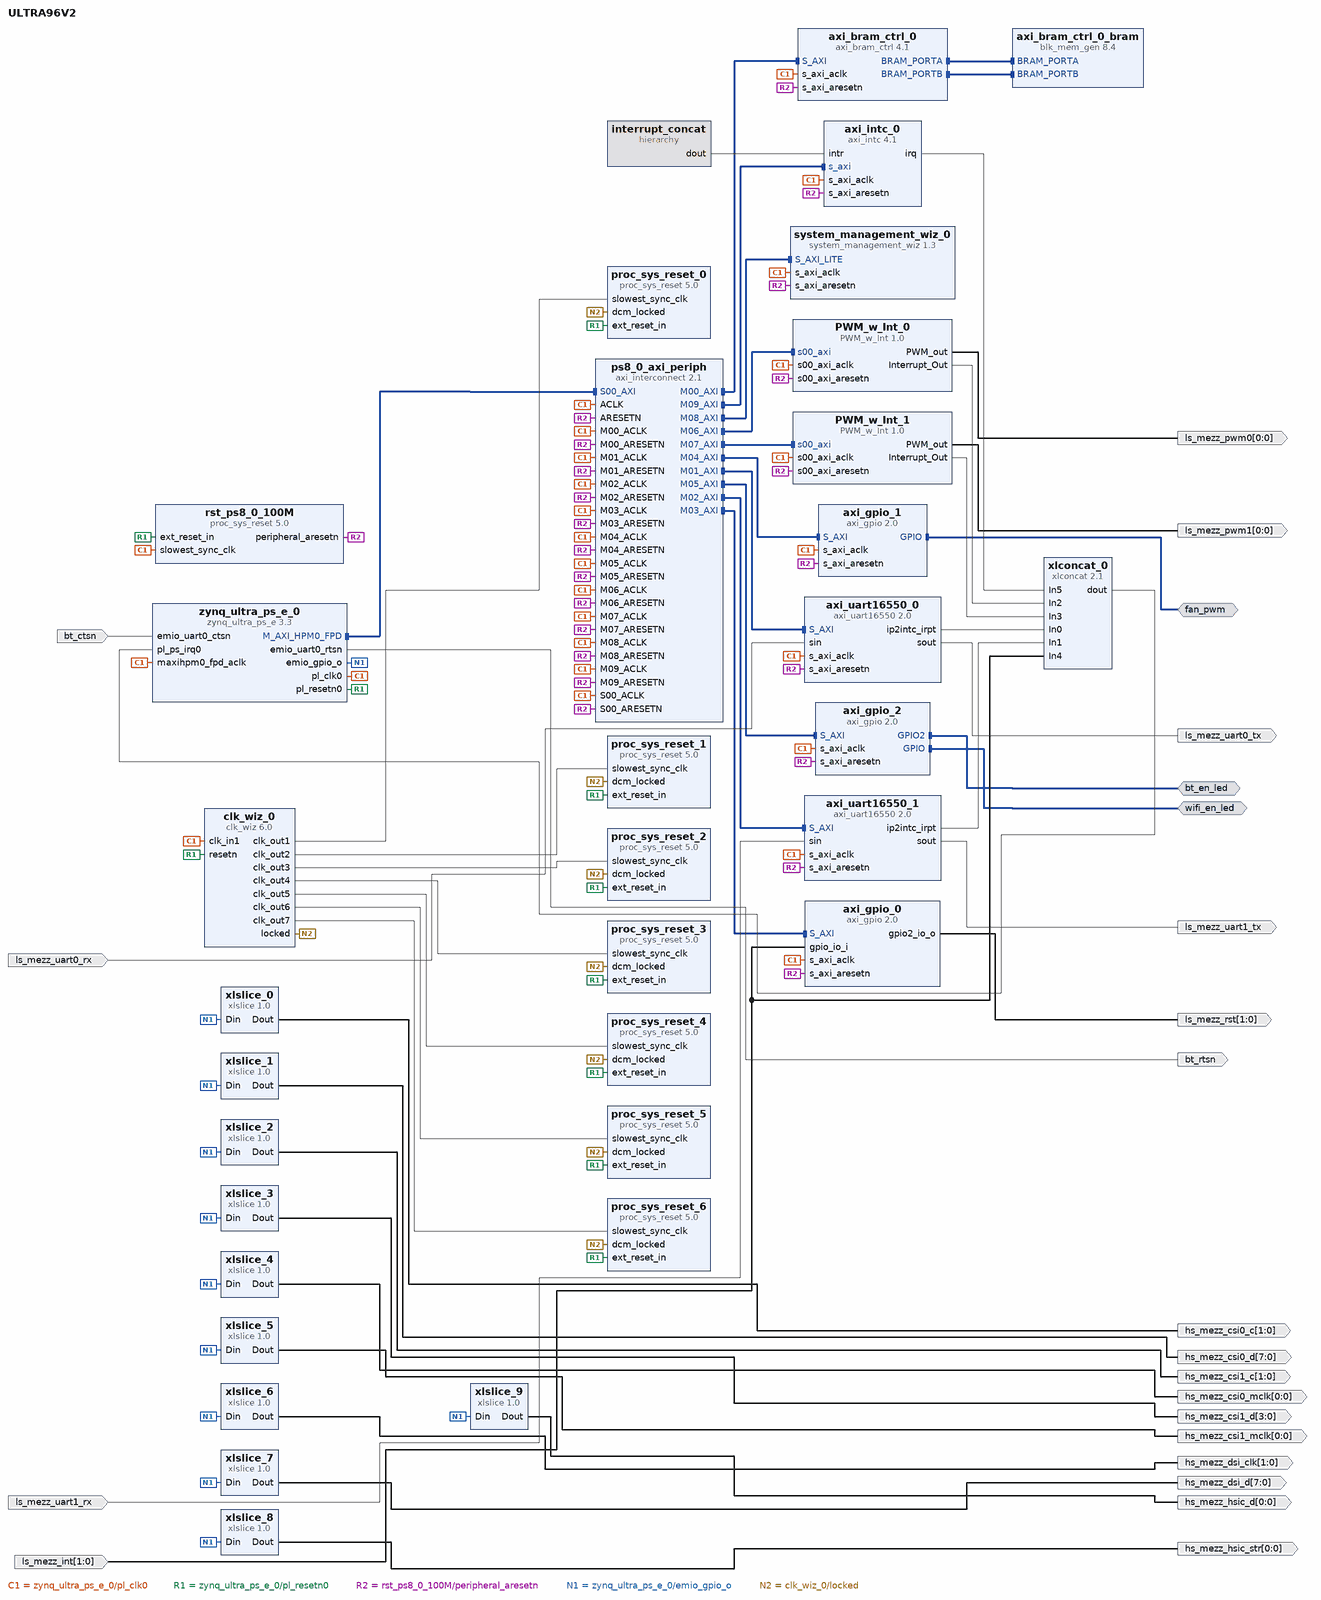
[diagram p0: block diagram of the top level]
# Vivado block design ULTRA96V2, xczu3eg-sbva484-1-e, Vivado 2019.2
create_bd_design ULTRA96V2

create_bd_intf_port -mode Master -vlnv xilinx.com:interface:gpio_rtl:1.0 fan_pwm
create_bd_intf_port -mode Master -vlnv xilinx.com:interface:gpio_rtl:1.0 wifi_en_led
create_bd_intf_port -mode Master -vlnv xilinx.com:interface:gpio_rtl:1.0 bt_en_led
create_bd_port -dir I ls_mezz_uart0_rx
create_bd_port -dir O ls_mezz_uart0_tx
create_bd_port -dir I ls_mezz_uart1_rx
create_bd_port -dir O ls_mezz_uart1_tx
create_bd_port -dir I -from 1 -to 0 ls_mezz_int
create_bd_port -dir O -from 1 -to 0 ls_mezz_rst
create_bd_port -dir O -from 0 -to 0 ls_mezz_pwm0
create_bd_port -dir O -from 0 -to 0 ls_mezz_pwm1
create_bd_port -dir I bt_ctsn
create_bd_port -dir O bt_rtsn
create_bd_port -dir O -from 1 -to 0 hs_mezz_csi0_c
create_bd_port -dir O -from 7 -to 0 hs_mezz_csi0_d
create_bd_port -dir O -from 1 -to 0 hs_mezz_csi1_c
create_bd_port -dir O -from 3 -to 0 hs_mezz_csi1_d
create_bd_port -dir O -from 0 -to 0 hs_mezz_csi0_mclk
create_bd_port -dir O -from 0 -to 0 hs_mezz_csi1_mclk
create_bd_port -dir O -from 1 -to 0 hs_mezz_dsi_clk
create_bd_port -dir O -from 7 -to 0 hs_mezz_dsi_d
create_bd_port -dir O -from 0 -to 0 hs_mezz_hsic_str
create_bd_port -dir O -from 0 -to 0 hs_mezz_hsic_d

create_bd_cell -type ip -vlnv xilinx.com:ip:zynq_ultra_ps_e:3.3 zynq_ultra_ps_e_0
set_property -dict [list \
  CONFIG.PSU_BANK_0_IO_STANDARD LVCMOS18 \
  CONFIG.PSU_BANK_1_IO_STANDARD LVCMOS18 \
  CONFIG.PSU_BANK_2_IO_STANDARD LVCMOS18 \
  CONFIG.PSU_BANK_3_IO_STANDARD LVCMOS18 \
  CONFIG.PSU_USB3__DUAL_CLOCK_ENABLE 1 \
  CONFIG.PSU__CAN1__PERIPHERAL__ENABLE 0 \
  CONFIG.PSU__CRF_APB__ACPU_CTRL__SRCSEL APLL \
  CONFIG.PSU__CRF_APB__APLL_CTRL__SRCSEL PSS_REF_CLK \
  CONFIG.PSU__CRF_APB__DBG_FPD_CTRL__SRCSEL IOPLL \
  CONFIG.PSU__CRF_APB__DBG_TRACE_CTRL__SRCSEL IOPLL \
  CONFIG.PSU__CRF_APB__DBG_TSTMP_CTRL__SRCSEL IOPLL \
  CONFIG.PSU__CRF_APB__DDR_CTRL__FREQMHZ 533 \
  CONFIG.PSU__CRF_APB__DDR_CTRL__SRCSEL DPLL \
  CONFIG.PSU__CRF_APB__DPDMA_REF_CTRL__SRCSEL APLL \
  CONFIG.PSU__CRF_APB__DPLL_CTRL__SRCSEL PSS_REF_CLK \
  CONFIG.PSU__CRF_APB__DP_AUDIO_REF_CTRL__SRCSEL RPLL \
  CONFIG.PSU__CRF_APB__DP_STC_REF_CTRL__SRCSEL RPLL \
  CONFIG.PSU__CRF_APB__DP_VIDEO_REF_CTRL__SRCSEL VPLL \
  CONFIG.PSU__CRF_APB__GDMA_REF_CTRL__SRCSEL APLL \
  CONFIG.PSU__CRF_APB__GPU_REF_CTRL__SRCSEL IOPLL \
  CONFIG.PSU__CRF_APB__TOPSW_LSBUS_CTRL__SRCSEL IOPLL \
  CONFIG.PSU__CRF_APB__TOPSW_MAIN_CTRL__SRCSEL DPLL \
  CONFIG.PSU__CRF_APB__VPLL_CTRL__SRCSEL PSS_REF_CLK \
  CONFIG.PSU__CRF_APB__VPLL_FRAC_CFG__ENABLED 1 \
  CONFIG.PSU__CRL_APB__ADMA_REF_CTRL__SRCSEL IOPLL \
  CONFIG.PSU__CRL_APB__CAN1_REF_CTRL__SRCSEL IOPLL \
  CONFIG.PSU__CRL_APB__CPU_R5_CTRL__SRCSEL IOPLL \
  CONFIG.PSU__CRL_APB__CSU_PLL_CTRL__FREQMHZ 400 \
  CONFIG.PSU__CRL_APB__CSU_PLL_CTRL__SRCSEL IOPLL \
  CONFIG.PSU__CRL_APB__DBG_LPD_CTRL__SRCSEL IOPLL \
  CONFIG.PSU__CRL_APB__GEM3_REF_CTRL__SRCSEL IOPLL \
  CONFIG.PSU__CRL_APB__I2C0_REF_CTRL__SRCSEL IOPLL \
  CONFIG.PSU__CRL_APB__I2C1_REF_CTRL__SRCSEL IOPLL \
  CONFIG.PSU__CRL_APB__IOPLL_CTRL__DIV2 0 \
  CONFIG.PSU__CRL_APB__IOPLL_CTRL__SRCSEL PSS_REF_CLK \
  CONFIG.PSU__CRL_APB__IOU_SWITCH_CTRL__SRCSEL IOPLL \
  CONFIG.PSU__CRL_APB__LPD_LSBUS_CTRL__SRCSEL IOPLL \
  CONFIG.PSU__CRL_APB__LPD_SWITCH_CTRL__SRCSEL IOPLL \
  CONFIG.PSU__CRL_APB__PCAP_CTRL__SRCSEL IOPLL \
  CONFIG.PSU__CRL_APB__PL0_REF_CTRL__SRCSEL IOPLL \
  CONFIG.PSU__CRL_APB__QSPI_REF_CTRL__SRCSEL IOPLL \
  CONFIG.PSU__CRL_APB__RPLL_CTRL__SRCSEL PSS_REF_CLK \
  CONFIG.PSU__CRL_APB__RPLL_FRAC_CFG__ENABLED 1 \
  CONFIG.PSU__CRL_APB__SDIO0_REF_CTRL__SRCSEL IOPLL \
  CONFIG.PSU__CRL_APB__SDIO1_REF_CTRL__SRCSEL IOPLL \
  CONFIG.PSU__CRL_APB__SPI0_REF_CTRL__SRCSEL IOPLL \
  CONFIG.PSU__CRL_APB__SPI1_REF_CTRL__SRCSEL IOPLL \
  CONFIG.PSU__CRL_APB__TIMESTAMP_REF_CTRL__SRCSEL IOPLL \
  CONFIG.PSU__CRL_APB__UART0_REF_CTRL__SRCSEL IOPLL \
  CONFIG.PSU__CRL_APB__UART1_REF_CTRL__SRCSEL IOPLL \
  CONFIG.PSU__CRL_APB__USB0_BUS_REF_CTRL__FREQMHZ 250 \
  CONFIG.PSU__CRL_APB__USB0_BUS_REF_CTRL__SRCSEL IOPLL \
  CONFIG.PSU__CRL_APB__USB3_DUAL_REF_CTRL__FREQMHZ 20 \
  CONFIG.PSU__CRL_APB__USB3_DUAL_REF_CTRL__SRCSEL IOPLL \
  CONFIG.PSU__CRL_APB__USB3__ENABLE 1 \
  CONFIG.PSU__CSUPMU__PERIPHERAL__VALID 1 \
  CONFIG.PSU__DDRC__BUS_WIDTH {32 Bit} \
  CONFIG.PSU__DDRC__DEVICE_CAPACITY {16384 MBits} \
  CONFIG.PSU__DDRC__DRAM_WIDTH {32 Bits} \
  CONFIG.PSU__DDRC__ECC Disabled \
  CONFIG.PSU__DDRC__MEMORY_TYPE {LPDDR 4} \
  CONFIG.PSU__DDRC__SPEED_BIN LPDDR4_1066 \
  CONFIG.PSU__DDR_HIGH_ADDRESS_GUI_ENABLE 0 \
  CONFIG.PSU__DDR__INTERFACE__FREQMHZ 266.500 \
  CONFIG.PSU__DISPLAYPORT__LANE0__ENABLE 1 \
  CONFIG.PSU__DISPLAYPORT__LANE0__IO {GT Lane1} \
  CONFIG.PSU__DISPLAYPORT__LANE1__ENABLE 1 \
  CONFIG.PSU__DISPLAYPORT__LANE1__IO {GT Lane0} \
  CONFIG.PSU__DISPLAYPORT__PERIPHERAL__ENABLE 1 \
  CONFIG.PSU__DLL__ISUSED 1 \
  CONFIG.PSU__DPAUX__PERIPHERAL__ENABLE 1 \
  CONFIG.PSU__DPAUX__PERIPHERAL__IO {MIO 27 .. 30} \
  CONFIG.PSU__DP__LANE_SEL {Dual Lower} \
  CONFIG.PSU__DP__REF_CLK_FREQ 27 \
  CONFIG.PSU__DP__REF_CLK_SEL {Ref Clk1} \
  CONFIG.PSU__ENET3__PERIPHERAL__ENABLE 0 \
  CONFIG.PSU__FPGA_PL0_ENABLE 1 \
  CONFIG.PSU__GPIO0_MIO__IO {MIO 0 .. 25} \
  CONFIG.PSU__GPIO0_MIO__PERIPHERAL__ENABLE 1 \
  CONFIG.PSU__GPIO1_MIO__IO {MIO 26 .. 51} \
  CONFIG.PSU__GPIO1_MIO__PERIPHERAL__ENABLE 1 \
  CONFIG.PSU__GPIO2_MIO__IO {MIO 52 .. 77} \
  CONFIG.PSU__GPIO2_MIO__PERIPHERAL__ENABLE 1 \
  CONFIG.PSU__GPIO_EMIO_WIDTH 30 \
  CONFIG.PSU__GPIO_EMIO__PERIPHERAL__ENABLE 1 \
  CONFIG.PSU__GPIO_EMIO__PERIPHERAL__IO 30 \
  CONFIG.PSU__GT__LINK_SPEED HBR \
  CONFIG.PSU__GT__PRE_EMPH_LVL_4 0 \
  CONFIG.PSU__GT__VLT_SWNG_LVL_4 0 \
  CONFIG.PSU__I2C0__PERIPHERAL__ENABLE 0 \
  CONFIG.PSU__I2C1__PERIPHERAL__ENABLE 1 \
  CONFIG.PSU__I2C1__PERIPHERAL__IO {MIO 4 .. 5} \
  CONFIG.PSU__IOU_SLCR__IOU_TTC_APB_CLK__TTC0_SEL APB \
  CONFIG.PSU__IOU_SLCR__IOU_TTC_APB_CLK__TTC1_SEL APB \
  CONFIG.PSU__IOU_SLCR__IOU_TTC_APB_CLK__TTC2_SEL APB \
  CONFIG.PSU__IOU_SLCR__IOU_TTC_APB_CLK__TTC3_SEL APB \
  CONFIG.PSU__MAXIGP0__DATA_WIDTH 128 \
  CONFIG.PSU__OVERRIDE__BASIC_CLOCK 1 \
  CONFIG.PSU__PMU_COHERENCY 0 \
  CONFIG.PSU__PMU__AIBACK__ENABLE 0 \
  CONFIG.PSU__PMU__EMIO_GPI__ENABLE 0 \
  CONFIG.PSU__PMU__EMIO_GPO__ENABLE 0 \
  CONFIG.PSU__PMU__GPI0__ENABLE 1 \
  CONFIG.PSU__PMU__GPI0__IO {MIO 26} \
  CONFIG.PSU__PMU__GPI1__ENABLE 0 \
  CONFIG.PSU__PMU__GPI2__ENABLE 0 \
  CONFIG.PSU__PMU__GPI3__ENABLE 0 \
  CONFIG.PSU__PMU__GPI4__ENABLE 0 \
  CONFIG.PSU__PMU__GPI5__ENABLE 0 \
  CONFIG.PSU__PMU__GPO0__ENABLE 1 \
  CONFIG.PSU__PMU__GPO0__IO {MIO 32} \
  CONFIG.PSU__PMU__GPO1__ENABLE 1 \
  CONFIG.PSU__PMU__GPO1__IO {MIO 33} \
  CONFIG.PSU__PMU__GPO2__ENABLE 1 \
  CONFIG.PSU__PMU__GPO2__IO {MIO 34} \
  CONFIG.PSU__PMU__GPO2__POLARITY high \
  CONFIG.PSU__PMU__GPO3__ENABLE 0 \
  CONFIG.PSU__PMU__GPO4__ENABLE 0 \
  CONFIG.PSU__PMU__GPO5__ENABLE 0 \
  CONFIG.PSU__PMU__PERIPHERAL__ENABLE 1 \
  CONFIG.PSU__PMU__PLERROR__ENABLE 0 \
  CONFIG.PSU__PRESET_APPLIED 1 \
  CONFIG.PSU__PSS_REF_CLK__FREQMHZ 33.333333 \
  CONFIG.PSU__QSPI__PERIPHERAL__ENABLE 0 \
  CONFIG.PSU__SATA__PERIPHERAL__ENABLE 0 \
  CONFIG.PSU__SD0__DATA_TRANSFER_MODE 4Bit \
  CONFIG.PSU__SD0__GRP_CD__ENABLE 1 \
  CONFIG.PSU__SD0__GRP_CD__IO {MIO 24} \
  CONFIG.PSU__SD0__PERIPHERAL__ENABLE 1 \
  CONFIG.PSU__SD0__PERIPHERAL__IO {MIO 13 .. 16 21 22} \
  CONFIG.PSU__SD0__SLOT_TYPE {SD 2.0} \
  CONFIG.PSU__SD1_COHERENCY 0 \
  CONFIG.PSU__SD1_ROUTE_THROUGH_FPD 0 \
  CONFIG.PSU__SD1__DATA_TRANSFER_MODE 4Bit \
  CONFIG.PSU__SD1__GRP_CD__ENABLE 0 \
  CONFIG.PSU__SD1__GRP_POW__ENABLE 0 \
  CONFIG.PSU__SD1__GRP_WP__ENABLE 0 \
  CONFIG.PSU__SD1__PERIPHERAL__ENABLE 1 \
  CONFIG.PSU__SD1__PERIPHERAL__IO {MIO 46 .. 51} \
  CONFIG.PSU__SD1__SLOT_TYPE {SD 2.0} \
  CONFIG.PSU__SPI0__GRP_SS0__IO {MIO 41} \
  CONFIG.PSU__SPI0__GRP_SS1__ENABLE 1 \
  CONFIG.PSU__SPI0__GRP_SS1__IO {MIO 40} \
  CONFIG.PSU__SPI0__GRP_SS2__ENABLE 1 \
  CONFIG.PSU__SPI0__GRP_SS2__IO {MIO 39} \
  CONFIG.PSU__SPI0__PERIPHERAL__ENABLE 1 \
  CONFIG.PSU__SPI0__PERIPHERAL__IO {MIO 38 .. 43} \
  CONFIG.PSU__SPI1__GRP_SS0__IO {MIO 9} \
  CONFIG.PSU__SPI1__PERIPHERAL__ENABLE 1 \
  CONFIG.PSU__SPI1__PERIPHERAL__IO {MIO 6 .. 11} \
  CONFIG.PSU__SWDT0__CLOCK__ENABLE 0 \
  CONFIG.PSU__SWDT0__PERIPHERAL__ENABLE 1 \
  CONFIG.PSU__SWDT0__RESET__ENABLE 0 \
  CONFIG.PSU__SWDT1__CLOCK__ENABLE 0 \
  CONFIG.PSU__SWDT1__PERIPHERAL__ENABLE 1 \
  CONFIG.PSU__SWDT1__RESET__ENABLE 0 \
  CONFIG.PSU__TTC0__CLOCK__ENABLE 0 \
  CONFIG.PSU__TTC0__PERIPHERAL__ENABLE 1 \
  CONFIG.PSU__TTC0__WAVEOUT__ENABLE 0 \
  CONFIG.PSU__TTC1__CLOCK__ENABLE 0 \
  CONFIG.PSU__TTC1__PERIPHERAL__ENABLE 1 \
  CONFIG.PSU__TTC1__WAVEOUT__ENABLE 0 \
  CONFIG.PSU__TTC2__CLOCK__ENABLE 0 \
  CONFIG.PSU__TTC2__PERIPHERAL__ENABLE 1 \
  CONFIG.PSU__TTC2__WAVEOUT__ENABLE 0 \
  CONFIG.PSU__TTC3__CLOCK__ENABLE 0 \
  CONFIG.PSU__TTC3__PERIPHERAL__ENABLE 1 \
  CONFIG.PSU__TTC3__WAVEOUT__ENABLE 0 \
  CONFIG.PSU__UART0__BAUD_RATE 115200 \
  CONFIG.PSU__UART0__MODEM__ENABLE 1 \
  CONFIG.PSU__UART0__PERIPHERAL__ENABLE 1 \
  CONFIG.PSU__UART0__PERIPHERAL__IO {MIO 2 .. 3} \
  CONFIG.PSU__UART1__BAUD_RATE 115200 \
  CONFIG.PSU__UART1__MODEM__ENABLE 0 \
  CONFIG.PSU__UART1__PERIPHERAL__ENABLE 1 \
  CONFIG.PSU__UART1__PERIPHERAL__IO {MIO 0 .. 1} \
  CONFIG.PSU__USB0_COHERENCY 0 \
  CONFIG.PSU__USB0__PERIPHERAL__ENABLE 1 \
  CONFIG.PSU__USB0__PERIPHERAL__IO {MIO 52 .. 63} \
  CONFIG.PSU__USB0__REF_CLK_FREQ 26 \
  CONFIG.PSU__USB0__REF_CLK_SEL {Ref Clk0} \
  CONFIG.PSU__USB1__PERIPHERAL__ENABLE 1 \
  CONFIG.PSU__USB1__PERIPHERAL__IO {MIO 64 .. 75} \
  CONFIG.PSU__USB1__REF_CLK_FREQ 26 \
  CONFIG.PSU__USB1__REF_CLK_SEL {Ref Clk0} \
  CONFIG.PSU__USB2_0__EMIO__ENABLE 0 \
  CONFIG.PSU__USB3_0__EMIO__ENABLE 0 \
  CONFIG.PSU__USB3_0__PERIPHERAL__ENABLE 1 \
  CONFIG.PSU__USB3_0__PERIPHERAL__IO {GT Lane2} \
  CONFIG.PSU__USB3_1__PERIPHERAL__ENABLE 1 \
  CONFIG.PSU__USB3_1__PERIPHERAL__IO {GT Lane3} \
  CONFIG.PSU__USB__RESET__MODE {Boot Pin} \
  CONFIG.PSU__USB__RESET__POLARITY {Active Low} \
  CONFIG.PSU__USE__IRQ0 1 \
  CONFIG.PSU__USE__M_AXI_GP0 1 \
  CONFIG.PSU__USE__M_AXI_GP1 0 \
  CONFIG.PSU__USE__M_AXI_GP2 0 \
  CONFIG.SUBPRESET1 Custom \
] [get_bd_cells zynq_ultra_ps_e_0]
# 259 more settings of zynq_ultra_ps_e_0 are not shown: defaults, MIO pin electricals, DDR timing, and values the tool derives
create_bd_cell -type ip -vlnv xilinx.com:ip:axi_interconnect:2.1 ps8_0_axi_periph
set_property -dict {CONFIG.NUM_MI 10} [get_bd_cells ps8_0_axi_periph]
create_bd_cell -type ip -vlnv xilinx.com:ip:proc_sys_reset:5.0 rst_ps8_0_100M
create_bd_cell -type ip -vlnv xilinx.com:ip:axi_bram_ctrl:4.1 axi_bram_ctrl_0
set_property -dict {CONFIG.DATA_WIDTH 128 CONFIG.SUPPORTS_NARROW_BURST 1} [get_bd_cells axi_bram_ctrl_0]
create_bd_cell -type ip -vlnv xilinx.com:ip:blk_mem_gen:8.4 axi_bram_ctrl_0_bram
set_property -dict {CONFIG.Memory_Type True_Dual_Port_RAM} [get_bd_cells axi_bram_ctrl_0_bram]
create_bd_cell -type ip -vlnv xilinx.com:ip:axi_uart16550:2.0 axi_uart16550_0
create_bd_cell -type ip -vlnv xilinx.com:ip:axi_uart16550:2.0 axi_uart16550_1
create_bd_cell -type ip -vlnv xilinx.com:ip:axi_gpio:2.0 axi_gpio_0
set_property -dict [list \
  CONFIG.C_ALL_INPUTS 1 \
  CONFIG.C_ALL_OUTPUTS_2 1 \
  CONFIG.C_GPIO2_WIDTH 2 \
  CONFIG.C_GPIO_WIDTH 2 \
  CONFIG.C_IS_DUAL 1 \
] [get_bd_cells axi_gpio_0]
create_bd_cell -type ip -vlnv xilinx.com:ip:axi_gpio:2.0 axi_gpio_1
set_property -dict [list \
  CONFIG.C_ALL_OUTPUTS 1 \
  CONFIG.C_DOUT_DEFAULT 0x00000001 \
  CONFIG.C_GPIO_WIDTH 1 \
  CONFIG.C_IS_DUAL 0 \
] [get_bd_cells axi_gpio_1]
create_bd_cell -type ip -vlnv xilinx.com:ip:axi_gpio:2.0 axi_gpio_2
set_property -dict [list \
  CONFIG.C_ALL_OUTPUTS 1 \
  CONFIG.C_ALL_OUTPUTS_2 1 \
  CONFIG.C_GPIO2_WIDTH 1 \
  CONFIG.C_GPIO_WIDTH 1 \
  CONFIG.C_IS_DUAL 1 \
] [get_bd_cells axi_gpio_2]
create_bd_cell -type ip -vlnv avnet.com:ip:PWM_w_Int:1.0 PWM_w_Int_0
create_bd_cell -type ip -vlnv avnet.com:ip:PWM_w_Int:1.0 PWM_w_Int_1
create_bd_cell -type ip -vlnv xilinx.com:ip:system_management_wiz:1.3 system_management_wiz_0
set_property -dict [list \
  CONFIG.CHANNEL_ENABLE_VP_VN false \
  CONFIG.ENABLE_VCCPSAUX_ALARM false \
  CONFIG.ENABLE_VCCPSINTFP_ALARM false \
  CONFIG.ENABLE_VCCPSINTLP_ALARM false \
  CONFIG.OT_ALARM false \
  CONFIG.USER_TEMP_ALARM false \
  CONFIG.VCCAUX_ALARM false \
  CONFIG.VCCINT_ALARM false \
] [get_bd_cells system_management_wiz_0]
create_bd_cell -type ip -vlnv xilinx.com:ip:xlconcat:2.1 xlconcat_0
set_property -dict {CONFIG.NUM_PORTS 6} [get_bd_cells xlconcat_0]
create_bd_cell -type ip -vlnv xilinx.com:ip:xlslice:1.0 xlslice_0
set_property -dict {CONFIG.DIN_FROM 29 CONFIG.DIN_TO 28 CONFIG.DIN_WIDTH 30 CONFIG.DOUT_WIDTH 2} [get_bd_cells xlslice_0]
create_bd_cell -type ip -vlnv xilinx.com:ip:xlslice:1.0 xlslice_1
set_property -dict {CONFIG.DIN_FROM 27 CONFIG.DIN_TO 20 CONFIG.DIN_WIDTH 30 CONFIG.DOUT_WIDTH 8} [get_bd_cells xlslice_1]
create_bd_cell -type ip -vlnv xilinx.com:ip:xlslice:1.0 xlslice_2
set_property -dict {CONFIG.DIN_FROM 19 CONFIG.DIN_TO 18 CONFIG.DIN_WIDTH 30 CONFIG.DOUT_WIDTH 2} [get_bd_cells xlslice_2]
create_bd_cell -type ip -vlnv xilinx.com:ip:xlslice:1.0 xlslice_3
set_property -dict {CONFIG.DIN_FROM 17 CONFIG.DIN_TO 14 CONFIG.DIN_WIDTH 30 CONFIG.DOUT_WIDTH 4} [get_bd_cells xlslice_3]
create_bd_cell -type ip -vlnv xilinx.com:ip:xlslice:1.0 xlslice_4
set_property -dict {CONFIG.DIN_FROM 13 CONFIG.DIN_TO 13 CONFIG.DIN_WIDTH 30 CONFIG.DOUT_WIDTH 1} [get_bd_cells xlslice_4]
create_bd_cell -type ip -vlnv xilinx.com:ip:xlslice:1.0 xlslice_5
set_property -dict {CONFIG.DIN_FROM 12 CONFIG.DIN_TO 12 CONFIG.DIN_WIDTH 30 CONFIG.DOUT_WIDTH 1} [get_bd_cells xlslice_5]
create_bd_cell -type ip -vlnv xilinx.com:ip:xlslice:1.0 xlslice_6
set_property -dict {CONFIG.DIN_FROM 11 CONFIG.DIN_TO 10 CONFIG.DIN_WIDTH 30 CONFIG.DOUT_WIDTH 2} [get_bd_cells xlslice_6]
create_bd_cell -type ip -vlnv xilinx.com:ip:xlslice:1.0 xlslice_7
set_property -dict {CONFIG.DIN_FROM 9 CONFIG.DIN_TO 2 CONFIG.DIN_WIDTH 30 CONFIG.DOUT_WIDTH 8} [get_bd_cells xlslice_7]
create_bd_cell -type ip -vlnv xilinx.com:ip:xlslice:1.0 xlslice_8
set_property -dict {CONFIG.DIN_FROM 1 CONFIG.DIN_TO 1 CONFIG.DIN_WIDTH 30 CONFIG.DOUT_WIDTH 1} [get_bd_cells xlslice_8]
create_bd_cell -type ip -vlnv xilinx.com:ip:xlslice:1.0 xlslice_9
set_property -dict {CONFIG.DIN_FROM 0 CONFIG.DIN_TO 0 CONFIG.DIN_WIDTH 30 CONFIG.DOUT_WIDTH 1} [get_bd_cells xlslice_9]
create_bd_cell -type ip -vlnv xilinx.com:ip:axi_intc:4.1 axi_intc_0
set_property -dict {CONFIG.C_IRQ_IS_LEVEL 1} [get_bd_cells axi_intc_0]
create_bd_cell -type hier interrupt_concat
create_bd_cell -type ip -vlnv xilinx.com:ip:clk_wiz:6.0 clk_wiz_0
set_property -dict [list \
  CONFIG.CLKOUT1_JITTER 107.567 \
  CONFIG.CLKOUT1_REQUESTED_OUT_FREQ 150 \
  CONFIG.CLKOUT2_JITTER 94.862 \
  CONFIG.CLKOUT2_PHASE_ERROR 87.180 \
  CONFIG.CLKOUT2_REQUESTED_OUT_FREQ 300 \
  CONFIG.CLKOUT2_USED true \
  CONFIG.CLKOUT3_JITTER 122.158 \
  CONFIG.CLKOUT3_PHASE_ERROR 87.180 \
  CONFIG.CLKOUT3_REQUESTED_OUT_FREQ 75 \
  CONFIG.CLKOUT3_USED true \
  CONFIG.CLKOUT4_JITTER 115.831 \
  CONFIG.CLKOUT4_PHASE_ERROR 87.180 \
  CONFIG.CLKOUT4_REQUESTED_OUT_FREQ 100.000 \
  CONFIG.CLKOUT4_USED true \
  CONFIG.CLKOUT5_JITTER 102.086 \
  CONFIG.CLKOUT5_PHASE_ERROR 87.180 \
  CONFIG.CLKOUT5_REQUESTED_OUT_FREQ 200.000 \
  CONFIG.CLKOUT5_USED true \
  CONFIG.CLKOUT6_JITTER 90.074 \
  CONFIG.CLKOUT6_PHASE_ERROR 87.180 \
  CONFIG.CLKOUT6_REQUESTED_OUT_FREQ 400.000 \
  CONFIG.CLKOUT6_USED true \
  CONFIG.CLKOUT7_JITTER 83.768 \
  CONFIG.CLKOUT7_PHASE_ERROR 87.180 \
  CONFIG.CLKOUT7_REQUESTED_OUT_FREQ 600.000 \
  CONFIG.CLKOUT7_USED true \
  CONFIG.MMCM_CLKOUT0_DIVIDE_F 8.000 \
  CONFIG.MMCM_CLKOUT1_DIVIDE 4 \
  CONFIG.MMCM_CLKOUT2_DIVIDE 16 \
  CONFIG.MMCM_CLKOUT3_DIVIDE 12 \
  CONFIG.MMCM_CLKOUT4_DIVIDE 6 \
  CONFIG.MMCM_CLKOUT5_DIVIDE 3 \
  CONFIG.MMCM_CLKOUT6_DIVIDE 2 \
  CONFIG.NUM_OUT_CLKS 7 \
  CONFIG.RESET_PORT resetn \
  CONFIG.RESET_TYPE ACTIVE_LOW \
] [get_bd_cells clk_wiz_0]
create_bd_cell -type ip -vlnv xilinx.com:ip:proc_sys_reset:5.0 proc_sys_reset_0
create_bd_cell -type ip -vlnv xilinx.com:ip:proc_sys_reset:5.0 proc_sys_reset_1
create_bd_cell -type ip -vlnv xilinx.com:ip:proc_sys_reset:5.0 proc_sys_reset_2
create_bd_cell -type ip -vlnv xilinx.com:ip:proc_sys_reset:5.0 proc_sys_reset_3
create_bd_cell -type ip -vlnv xilinx.com:ip:proc_sys_reset:5.0 proc_sys_reset_4
create_bd_cell -type ip -vlnv xilinx.com:ip:proc_sys_reset:5.0 proc_sys_reset_5
create_bd_cell -type ip -vlnv xilinx.com:ip:proc_sys_reset:5.0 proc_sys_reset_6

# ---- hierarchy /interrupt_concat ----
current_bd_instance /interrupt_concat
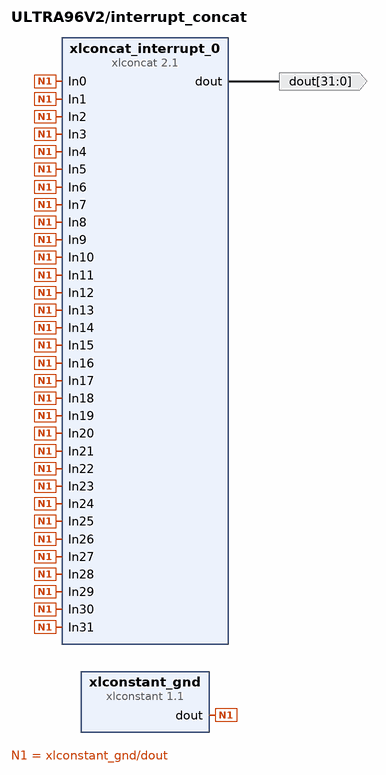
[diagram p1: block diagram inside /interrupt_concat]
create_bd_pin -dir O -from 31 -to 0 dout

create_bd_cell -type ip -vlnv xilinx.com:ip:xlconcat:2.1 xlconcat_interrupt_0
set_property -dict {CONFIG.NUM_PORTS 32} [get_bd_cells xlconcat_interrupt_0]
create_bd_cell -type ip -vlnv xilinx.com:ip:xlconstant:1.1 xlconstant_gnd
set_property -dict {CONFIG.CONST_VAL 0} [get_bd_cells xlconstant_gnd]

# ---- connections ----

current_bd_instance /interrupt_concat
connect_bd_net [get_bd_pins xlconcat_interrupt_0/dout] [get_bd_pins dout]
connect_bd_net [get_bd_pins xlconstant_gnd/dout] \
  [get_bd_pins xlconcat_interrupt_0/In0] [get_bd_pins xlconcat_interrupt_0/In1] [get_bd_pins xlconcat_interrupt_0/In2] \
  [get_bd_pins xlconcat_interrupt_0/In3] [get_bd_pins xlconcat_interrupt_0/In4] [get_bd_pins xlconcat_interrupt_0/In5] \
  [get_bd_pins xlconcat_interrupt_0/In6] [get_bd_pins xlconcat_interrupt_0/In7] [get_bd_pins xlconcat_interrupt_0/In8] \
  [get_bd_pins xlconcat_interrupt_0/In9] [get_bd_pins xlconcat_interrupt_0/In10] [get_bd_pins xlconcat_interrupt_0/In11] \
  [get_bd_pins xlconcat_interrupt_0/In12] [get_bd_pins xlconcat_interrupt_0/In13] [get_bd_pins xlconcat_interrupt_0/In14] \
  [get_bd_pins xlconcat_interrupt_0/In15] [get_bd_pins xlconcat_interrupt_0/In16] [get_bd_pins xlconcat_interrupt_0/In17] \
  [get_bd_pins xlconcat_interrupt_0/In18] [get_bd_pins xlconcat_interrupt_0/In19] [get_bd_pins xlconcat_interrupt_0/In20] \
  [get_bd_pins xlconcat_interrupt_0/In21] [get_bd_pins xlconcat_interrupt_0/In22] [get_bd_pins xlconcat_interrupt_0/In23] \
  [get_bd_pins xlconcat_interrupt_0/In24] [get_bd_pins xlconcat_interrupt_0/In25] [get_bd_pins xlconcat_interrupt_0/In26] \
  [get_bd_pins xlconcat_interrupt_0/In27] [get_bd_pins xlconcat_interrupt_0/In28] [get_bd_pins xlconcat_interrupt_0/In29] \
  [get_bd_pins xlconcat_interrupt_0/In30] [get_bd_pins xlconcat_interrupt_0/In31]

current_bd_instance /
connect_bd_intf_net [get_bd_intf_pins ps8_0_axi_periph/M00_AXI] [get_bd_intf_pins axi_bram_ctrl_0/S_AXI]
connect_bd_intf_net [get_bd_intf_pins ps8_0_axi_periph/S00_AXI] [get_bd_intf_pins zynq_ultra_ps_e_0/M_AXI_HPM0_FPD]
connect_bd_intf_net [get_bd_intf_ports bt_en_led] [get_bd_intf_pins axi_gpio_2/GPIO2]
connect_bd_intf_net [get_bd_intf_pins ps8_0_axi_periph/M05_AXI] [get_bd_intf_pins axi_gpio_2/S_AXI]
connect_bd_intf_net [get_bd_intf_ports wifi_en_led] [get_bd_intf_pins axi_gpio_2/GPIO]
connect_bd_intf_net [get_bd_intf_pins ps8_0_axi_periph/M03_AXI] [get_bd_intf_pins axi_gpio_0/S_AXI]
connect_bd_intf_net [get_bd_intf_pins ps8_0_axi_periph/M07_AXI] [get_bd_intf_pins PWM_w_Int_1/s00_axi]
connect_bd_intf_net [get_bd_intf_pins ps8_0_axi_periph/M02_AXI] [get_bd_intf_pins axi_uart16550_1/S_AXI]
connect_bd_intf_net [get_bd_intf_pins ps8_0_axi_periph/M01_AXI] [get_bd_intf_pins axi_uart16550_0/S_AXI]
connect_bd_intf_net [get_bd_intf_pins axi_bram_ctrl_0_bram/BRAM_PORTA] [get_bd_intf_pins axi_bram_ctrl_0/BRAM_PORTA]
connect_bd_intf_net [get_bd_intf_pins axi_bram_ctrl_0_bram/BRAM_PORTB] [get_bd_intf_pins axi_bram_ctrl_0/BRAM_PORTB]
connect_bd_intf_net [get_bd_intf_pins ps8_0_axi_periph/M04_AXI] [get_bd_intf_pins axi_gpio_1/S_AXI]
connect_bd_intf_net [get_bd_intf_ports fan_pwm] [get_bd_intf_pins axi_gpio_1/GPIO]
connect_bd_intf_net [get_bd_intf_pins ps8_0_axi_periph/M06_AXI] [get_bd_intf_pins PWM_w_Int_0/s00_axi]
connect_bd_intf_net [get_bd_intf_pins ps8_0_axi_periph/M09_AXI] [get_bd_intf_pins axi_intc_0/s_axi]
connect_bd_intf_net [get_bd_intf_pins ps8_0_axi_periph/M08_AXI] [get_bd_intf_pins system_management_wiz_0/S_AXI_LITE]
connect_bd_net [get_bd_pins zynq_ultra_ps_e_0/pl_clk0] \
  [get_bd_pins zynq_ultra_ps_e_0/maxihpm0_fpd_aclk] [get_bd_pins rst_ps8_0_100M/slowest_sync_clk] \
  [get_bd_pins ps8_0_axi_periph/ACLK] [get_bd_pins ps8_0_axi_periph/S00_ACLK] [get_bd_pins axi_bram_ctrl_0/s_axi_aclk] \
  [get_bd_pins ps8_0_axi_periph/M00_ACLK] [get_bd_pins axi_uart16550_0/s_axi_aclk] [get_bd_pins ps8_0_axi_periph/M01_ACLK] \
  [get_bd_pins axi_uart16550_1/s_axi_aclk] [get_bd_pins ps8_0_axi_periph/M02_ACLK] [get_bd_pins axi_gpio_0/s_axi_aclk] \
  [get_bd_pins ps8_0_axi_periph/M03_ACLK] [get_bd_pins axi_gpio_1/s_axi_aclk] [get_bd_pins ps8_0_axi_periph/M04_ACLK] \
  [get_bd_pins axi_gpio_2/s_axi_aclk] [get_bd_pins ps8_0_axi_periph/M05_ACLK] [get_bd_pins PWM_w_Int_0/s00_axi_aclk] \
  [get_bd_pins ps8_0_axi_periph/M06_ACLK] [get_bd_pins PWM_w_Int_1/s00_axi_aclk] [get_bd_pins ps8_0_axi_periph/M07_ACLK] \
  [get_bd_pins system_management_wiz_0/s_axi_aclk] [get_bd_pins ps8_0_axi_periph/M08_ACLK] \
  [get_bd_pins axi_intc_0/s_axi_aclk] [get_bd_pins ps8_0_axi_periph/M09_ACLK] [get_bd_pins clk_wiz_0/clk_in1]
connect_bd_net [get_bd_pins zynq_ultra_ps_e_0/pl_resetn0] \
  [get_bd_pins rst_ps8_0_100M/ext_reset_in] [get_bd_pins clk_wiz_0/resetn] [get_bd_pins proc_sys_reset_0/ext_reset_in] \
  [get_bd_pins proc_sys_reset_1/ext_reset_in] [get_bd_pins proc_sys_reset_2/ext_reset_in] \
  [get_bd_pins proc_sys_reset_3/ext_reset_in] [get_bd_pins proc_sys_reset_4/ext_reset_in] \
  [get_bd_pins proc_sys_reset_5/ext_reset_in] [get_bd_pins proc_sys_reset_6/ext_reset_in]
connect_bd_net -net proc_sys_reset_0_peripheral_aresetn [get_bd_pins rst_ps8_0_100M/peripheral_aresetn] \
  [get_bd_pins ps8_0_axi_periph/ARESETN] [get_bd_pins ps8_0_axi_periph/S00_ARESETN] \
  [get_bd_pins axi_bram_ctrl_0/s_axi_aresetn] [get_bd_pins ps8_0_axi_periph/M00_ARESETN] \
  [get_bd_pins axi_uart16550_0/s_axi_aresetn] [get_bd_pins ps8_0_axi_periph/M01_ARESETN] \
  [get_bd_pins axi_uart16550_1/s_axi_aresetn] [get_bd_pins ps8_0_axi_periph/M02_ARESETN] \
  [get_bd_pins axi_gpio_0/s_axi_aresetn] [get_bd_pins ps8_0_axi_periph/M03_ARESETN] [get_bd_pins axi_gpio_1/s_axi_aresetn] \
  [get_bd_pins ps8_0_axi_periph/M04_ARESETN] [get_bd_pins axi_gpio_2/s_axi_aresetn] \
  [get_bd_pins ps8_0_axi_periph/M05_ARESETN] [get_bd_pins PWM_w_Int_0/s00_axi_aresetn] \
  [get_bd_pins ps8_0_axi_periph/M06_ARESETN] [get_bd_pins PWM_w_Int_1/s00_axi_aresetn] \
  [get_bd_pins ps8_0_axi_periph/M07_ARESETN] [get_bd_pins system_management_wiz_0/s_axi_aresetn] \
  [get_bd_pins ps8_0_axi_periph/M08_ARESETN] [get_bd_pins axi_intc_0/s_axi_aresetn] \
  [get_bd_pins ps8_0_axi_periph/M09_ARESETN]
connect_bd_net -net sin_0_1 [get_bd_ports ls_mezz_uart0_rx] [get_bd_pins axi_uart16550_0/sin]
connect_bd_net [get_bd_pins axi_uart16550_0/sout] [get_bd_ports ls_mezz_uart0_tx]
connect_bd_net -net sin_0_2 [get_bd_ports ls_mezz_uart1_rx] [get_bd_pins axi_uart16550_1/sin]
connect_bd_net [get_bd_pins axi_uart16550_1/sout] [get_bd_ports ls_mezz_uart1_tx]
connect_bd_net -net gpio_io_i_0_1 [get_bd_ports ls_mezz_int] [get_bd_pins axi_gpio_0/gpio_io_i] [get_bd_pins xlconcat_0/In4]
connect_bd_net [get_bd_pins axi_gpio_0/gpio2_io_o] [get_bd_ports ls_mezz_rst]
connect_bd_net [get_bd_pins PWM_w_Int_0/PWM_out] [get_bd_ports ls_mezz_pwm0]
connect_bd_net [get_bd_pins PWM_w_Int_1/PWM_out] [get_bd_ports ls_mezz_pwm1]
connect_bd_net [get_bd_pins xlconcat_0/dout] [get_bd_pins zynq_ultra_ps_e_0/pl_ps_irq0]
connect_bd_net [get_bd_pins axi_uart16550_0/ip2intc_irpt] [get_bd_pins xlconcat_0/In0]
connect_bd_net [get_bd_pins axi_uart16550_1/ip2intc_irpt] [get_bd_pins xlconcat_0/In1]
connect_bd_net [get_bd_pins PWM_w_Int_0/Interrupt_Out] [get_bd_pins xlconcat_0/In2]
connect_bd_net [get_bd_pins PWM_w_Int_1/Interrupt_Out] [get_bd_pins xlconcat_0/In3]
connect_bd_net -net emio_uart0_ctsn_0_1 [get_bd_ports bt_ctsn] [get_bd_pins zynq_ultra_ps_e_0/emio_uart0_ctsn]
connect_bd_net [get_bd_pins zynq_ultra_ps_e_0/emio_uart0_rtsn] [get_bd_ports bt_rtsn]
connect_bd_net [get_bd_pins zynq_ultra_ps_e_0/emio_gpio_o] \
  [get_bd_pins xlslice_0/Din] [get_bd_pins xlslice_1/Din] [get_bd_pins xlslice_2/Din] [get_bd_pins xlslice_3/Din] \
  [get_bd_pins xlslice_4/Din] [get_bd_pins xlslice_5/Din] [get_bd_pins xlslice_6/Din] [get_bd_pins xlslice_7/Din] \
  [get_bd_pins xlslice_8/Din] [get_bd_pins xlslice_9/Din]
connect_bd_net [get_bd_pins xlslice_0/Dout] [get_bd_ports hs_mezz_csi0_c]
connect_bd_net [get_bd_pins xlslice_1/Dout] [get_bd_ports hs_mezz_csi0_d]
connect_bd_net [get_bd_pins xlslice_2/Dout] [get_bd_ports hs_mezz_csi1_c]
connect_bd_net [get_bd_pins xlslice_3/Dout] [get_bd_ports hs_mezz_csi1_d]
connect_bd_net [get_bd_pins xlslice_4/Dout] [get_bd_ports hs_mezz_csi0_mclk]
connect_bd_net [get_bd_pins xlslice_5/Dout] [get_bd_ports hs_mezz_csi1_mclk]
connect_bd_net [get_bd_pins xlslice_6/Dout] [get_bd_ports hs_mezz_dsi_clk]
connect_bd_net [get_bd_pins xlslice_7/Dout] [get_bd_ports hs_mezz_dsi_d]
connect_bd_net [get_bd_pins xlslice_8/Dout] [get_bd_ports hs_mezz_hsic_str]
connect_bd_net [get_bd_pins xlslice_9/Dout] [get_bd_ports hs_mezz_hsic_d]
connect_bd_net [get_bd_pins interrupt_concat/dout] [get_bd_pins axi_intc_0/intr]
connect_bd_net [get_bd_pins axi_intc_0/irq] [get_bd_pins xlconcat_0/In5]
connect_bd_net [get_bd_pins clk_wiz_0/clk_out1] [get_bd_pins proc_sys_reset_0/slowest_sync_clk]
connect_bd_net [get_bd_pins clk_wiz_0/clk_out2] [get_bd_pins proc_sys_reset_1/slowest_sync_clk]
connect_bd_net [get_bd_pins clk_wiz_0/clk_out3] [get_bd_pins proc_sys_reset_2/slowest_sync_clk]
connect_bd_net [get_bd_pins clk_wiz_0/clk_out4] [get_bd_pins proc_sys_reset_3/slowest_sync_clk]
connect_bd_net [get_bd_pins clk_wiz_0/clk_out5] [get_bd_pins proc_sys_reset_4/slowest_sync_clk]
connect_bd_net [get_bd_pins clk_wiz_0/clk_out6] [get_bd_pins proc_sys_reset_5/slowest_sync_clk]
connect_bd_net [get_bd_pins clk_wiz_0/clk_out7] [get_bd_pins proc_sys_reset_6/slowest_sync_clk]
connect_bd_net [get_bd_pins clk_wiz_0/locked] \
  [get_bd_pins proc_sys_reset_0/dcm_locked] [get_bd_pins proc_sys_reset_1/dcm_locked] \
  [get_bd_pins proc_sys_reset_2/dcm_locked] [get_bd_pins proc_sys_reset_3/dcm_locked] \
  [get_bd_pins proc_sys_reset_4/dcm_locked] [get_bd_pins proc_sys_reset_5/dcm_locked] \
  [get_bd_pins proc_sys_reset_6/dcm_locked]
set_property PFM.AXI_PORT {  M_AXI_HPM1_FPD {memport "M_AXI_GP"}   S_AXI_HPC0_FPD {memport "S_AXI_HPC" sptag "HPC0" memory "zynq_ultra_ps_e_0 HPC0_DDR_LOW"}  S_AXI_HPC1_FPD {memport "S_AXI_HPC" sptag "HPC1" memory "zynq_ultra_ps_e_0 HPC1_DDR_LOW"}  S_AXI_HP0_FPD {memport "S_AXI_HP" sptag "HP0" memory "zynq_ultra_ps_e_0 HP0_DDR_LOW"}  S_AXI_HP1_FPD {memport "S_AXI_HP" sptag "HP1" memory "zynq_ultra_ps_e_0 HP1_DDR_LOW"}  S_AXI_HP2_FPD {memport "S_AXI_HP" sptag "HP2" memory "zynq_ultra_ps_e_0 HP2_DDR_LOW"}  S_AXI_HP3_FPD {memport "S_AXI_HP" sptag "HP3" memory "zynq_ultra_ps_e_0 HP3_DDR_LOW"}  } [get_bd_cells zynq_ultra_ps_e_0]
set_property PFM.CLOCK {  clk_out1 {id "0" is_default "true" proc_sys_reset "proc_sys_reset_0" status "fixed"}  clk_out2 {id "1" is_default "false" proc_sys_reset "proc_sys_reset_1" status "fixed"}  clk_out3 {id "2" is_default "false" proc_sys_reset "/proc_sys_reset_2" status "fixed"}  clk_out4 {id "3" is_default "false" proc_sys_reset "/proc_sys_reset_3" status "fixed"}  clk_out5 {id "4" is_default "false" proc_sys_reset "/proc_sys_reset_4" status "fixed"}  clk_out6 {id "5" is_default "false" proc_sys_reset "/proc_sys_reset_5" status "fixed"}  clk_out7 {id "6" is_default "false" proc_sys_reset "/proc_sys_reset_6" status "fixed"}  } [get_bd_cells clk_wiz_0]

# ---- address map ----
assign_bd_address -offset 0x00A0000000 -range 8K -target_address_space [get_bd_addr_spaces zynq_ultra_ps_e_0/Data] [get_bd_addr_segs axi_bram_ctrl_0/S_AXI/Mem0]
assign_bd_address -offset 0x00A0010000 -range 64K -target_address_space [get_bd_addr_spaces zynq_ultra_ps_e_0/Data] [get_bd_addr_segs axi_uart16550_0/S_AXI/Reg]
assign_bd_address -offset 0x00A0020000 -range 64K -target_address_space [get_bd_addr_spaces zynq_ultra_ps_e_0/Data] [get_bd_addr_segs axi_uart16550_1/S_AXI/Reg]
assign_bd_address -offset 0x00A0030000 -range 64K -target_address_space [get_bd_addr_spaces zynq_ultra_ps_e_0/Data] [get_bd_addr_segs axi_gpio_0/S_AXI/Reg]
assign_bd_address -offset 0x00A0040000 -range 64K -target_address_space [get_bd_addr_spaces zynq_ultra_ps_e_0/Data] [get_bd_addr_segs axi_gpio_1/S_AXI/Reg]
assign_bd_address -offset 0x00A0050000 -range 64K -target_address_space [get_bd_addr_spaces zynq_ultra_ps_e_0/Data] [get_bd_addr_segs axi_gpio_2/S_AXI/Reg]
assign_bd_address -offset 0x00A0060000 -range 64K -target_address_space [get_bd_addr_spaces zynq_ultra_ps_e_0/Data] [get_bd_addr_segs PWM_w_Int_0/s00_axi/reg0]
assign_bd_address -offset 0x00A0070000 -range 64K -target_address_space [get_bd_addr_spaces zynq_ultra_ps_e_0/Data] [get_bd_addr_segs PWM_w_Int_1/s00_axi/reg0]
assign_bd_address -offset 0x00A0080000 -range 64K -target_address_space [get_bd_addr_spaces zynq_ultra_ps_e_0/Data] [get_bd_addr_segs system_management_wiz_0/S_AXI_LITE/Reg]
assign_bd_address -offset 0x00A0090000 -range 64K -target_address_space [get_bd_addr_spaces zynq_ultra_ps_e_0/Data] [get_bd_addr_segs axi_intc_0/S_AXI/Reg]

validate_bd_design
save_bd_design
